# EAGLE schematic schematic (EAGLE 7.3.0)
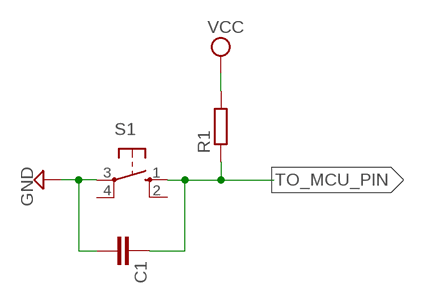
[diagram p0: schematic, sheet 1]

## Parts
C1  C5/2.5  [C5B2.5]
R1  R0204/7  [0204/7]
S1  10-XX  [B3F-10XX]

## Nets
GND: C1.2
TO_MCU_PIN: C1.1 R1.1 S1.1(S)
VCC: R1.2
Unconnected: S1.2(S1) S1.3(P) S1.4(P1)

## Library data of the parts
C1 = capacitor-wima:C: CAPACITOR naming: grid - package width
R1 = eagle-ltspice:R: RESISTOR, European symbol; SPICEMODEL: NONE; SPICEPREFIX: R
S1 = switch-omron:10-XX: OMRON SWITCH; MPN: B3F-1000; OC_FARNELL: 176432; OC_NEWARK: 36M3542